# Altium schematic sheet AD Sensor Module - SC.SchDoc
size B
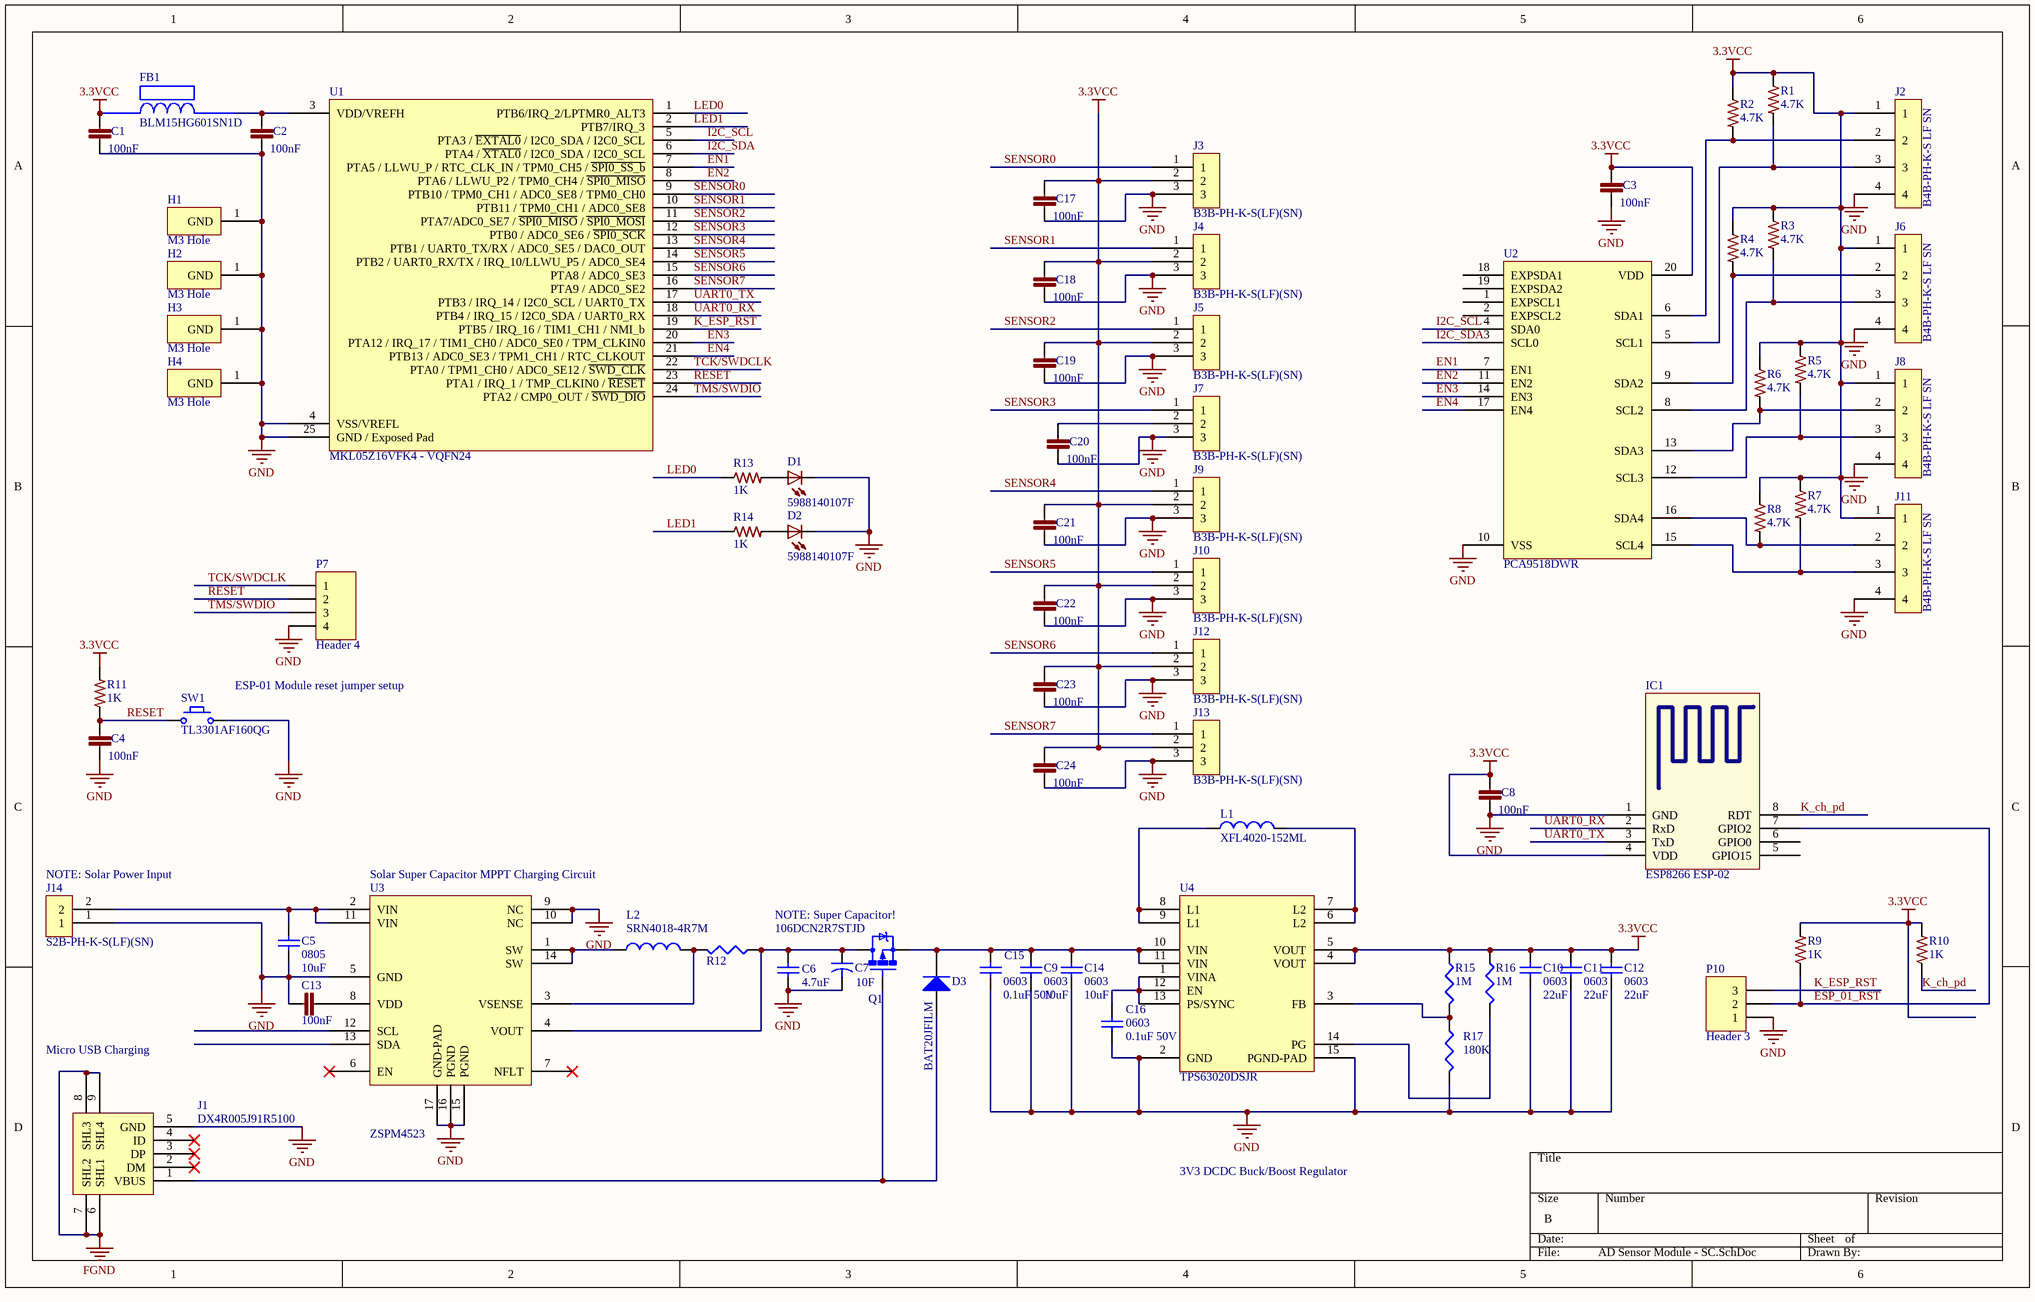
[diagram p0: AD Sensor Module - SC.SchDoc]

## Parts
C1  100nF  [C0402]
C2  100nF  [C0402]
C3  100nF  [C0402]
C4  100nF  [C0402]
C5  0805  value 10uF  [C0805]
C6  value 4.7uF  [C0805]  (hidden comment: CL21F475ZPFNNNE)
C7  106DCN2R7STJD  value 10F  [106DCN2R7STJD]
C8  100nF  [C0402]
C9  0603  value 10uF  [C0603]
C10  0603  value 22uF  [C0603]
C11  0603  value 22uF  [C0603]
C12  0603  value 22uF  [C0603]
C13  100nF  [C0402]
C14  0603  value 10uF  [C0603]
C15  0603  value 0.1uF 50V  [C0603]
C16  0603  value 0.1uF 50V  [C0603]
C17  100nF  [C0402]
C18  100nF  [C0402]
C19  100nF  [C0402]
C20  100nF  [C0402]
C21  100nF  [C0402]
C22  100nF  [C0402]
C23  100nF  [C0402]
C24  100nF  [C0402]
D1  5988140107F  [LED2012120]
D2  5988140107F  [LED2012120]
D3  BAT20JFILM  [BAT20JFILM - DIOM1712X11N]
FB1  BLM15HG601SN1D  [BLM18PG121SN1D]
H1  M3 Hole  [Hole-3mm]
H2  M3 Hole  [Hole-3mm]
H3  M3 Hole  [Hole-3mm]
H4  M3 Hole  [Hole-3mm]
IC1  ESP8266 ESP-02  [ESP8266 ESP-02]
J1  DX4R005J91R5100  [Micro USB Circular Holes Only]
J2  B4B-PH-K-S LF SN  [B4B-PH-K-S(LF)(SN)]
J3  B3B-PH-K-S(LF)(SN)  [B3B-PH-K-S(LF)(SN)]
J4  B3B-PH-K-S(LF)(SN)  [B3B-PH-K-S(LF)(SN)]
J5  B3B-PH-K-S(LF)(SN)  [B3B-PH-K-S(LF)(SN)]
J6  B4B-PH-K-S LF SN  [B4B-PH-K-S(LF)(SN)]
J7  B3B-PH-K-S(LF)(SN)  [B3B-PH-K-S(LF)(SN)]
J8  B4B-PH-K-S LF SN  [B4B-PH-K-S(LF)(SN)]
J9  B3B-PH-K-S(LF)(SN)  [B3B-PH-K-S(LF)(SN)]
J10  B3B-PH-K-S(LF)(SN)  [B3B-PH-K-S(LF)(SN)]
J11  B4B-PH-K-S LF SN  [B4B-PH-K-S(LF)(SN)]
J12  B3B-PH-K-S(LF)(SN)  [B3B-PH-K-S(LF)(SN)]
J13  B3B-PH-K-S(LF)(SN)  [B3B-PH-K-S(LF)(SN)]
J14  S2B-PH-K-S(LF)(SN)  [S2B-PH-K-S(LF)(SN)]
L1  XFL4020-152ML  [XFL4020-152ML - INDP4040X21N]
L2  SRN4018-4R7M  [SRN4018-4R7M - INDP4040X18N]
P7  Header 4  [HDR1X4]
P10  Header 3  [HDR1X3]
Q1  DMG2307L-7  [DMG2307L-7 - SOT92P240X102-3N]  (value not drawn)
R1  4.7K  [R0603]
R2  4.7K  [R0603]
R3  4.7K  [R0603]
R4  4.7K  [R0603]
R5  4.7K  [R0603]
R6  4.7K  [R0603]
R7  4.7K  [R0603]
R8  4.7K  [R0603]
R9  1K  [R0603]
R10  1K  [R0603]
R11  1K  [R0603]
R12  RU3216FR051CS  [R1206]  (value not drawn)
R13  1K  [R0603]
R14  1K  [R0603]
R15  value 1M  [R0603]  (hidden comment: RC1608F105CS)
R16  value 1M  [R0603]  (hidden comment: RC1608F105CS)
R17  value 180K  [R0603]  (hidden comment: RC1608F184CS)
SW1  TL3301AF160QG  [TL3301AF160QG]
U1  MKL05Z16VFK4 - VQFN24  [98ASA00474D]
U2  PCA9518DWR  [PCA9518DWR]
U3  ZSPM4523  [ZSPM4523 - QFN65P400X400X100_HS-17N]
U4  TPS63020DSJR  [TPS63020 - QFN50P400X300X100-22N]

## Nets
3.3VCC: C1.1 C3.1 C8.1 C10.2 C11.2 C12.2 C17.1 C18.1 C19.1 C21.1 C22.1 C23.1 C24.1 FB1.1 IC1.4(VDD) J2.1 J3.2 J4.2 J5.2 J6.1 J8.1 J9.2 J10.2 J11.1 J12.2 J13.2 R1.1 R2.1 R3.1 R4.1 R5.1 R6.1 R7.1 R8.1 R9.2 R10.2 R11.2 R15.1 R16.1 U2.20(VDD) U4.4(VOUT) U4.5(VOUT)
FGND: J1.6(SHL1) J1.7(SHL2) J1.8(SHL3) J1.9(SHL4)
GND: C1.2 C2.2 C3.2 C4.2 C5.1 C6.1 C7.2 C8.2 C9.1 C10.1 C11.1 C12.1 C13.2 C14.1 C15.1 C16.1 C17.2 C18.2 C19.2 C20.2 C21.2 C22.2 C23.2 C24.2 D1.C D2.C H1.1(GND) H2.1(GND) H3.1(GND) H4.1(GND) IC1.1(GND) J1.5(GND) J2.4 J3.3 J4.3 J5.3 J6.4 J7.3 J8.4 J9.3 J10.3 J11.4 J12.3 J13.3 J14.1 P7.4 P10.1 R17.2 SW1.2 U1.4(VSS/VREFL) U1.25(GND_/_Exposed_Pad) U2.10(VSS) U3.5(GND) U3.9(NC) U3.10(NC) U3.15(PGND) U3.16(PGND) U3.17(GND-PAD) U4.2(GND) U4.15(PGND-PAD)
EN1: U1.7(PTA5_/_LLWU_P_/_RTC_CLK_IN_/_TPM0_CH5_/_~{SPI0_SS_b}) U2.7(EN1)
EN2: U1.8(PTA6_/_LLWU_P2_/_TPM0_CH4_/_~{SPI0_MISO}) U2.11(EN2)
EN3: U1.20(PTA12_/_IRQ_17_/_TIM1_CH0_/_ADC0_SE0_/_TPM_CLKIN0) U2.14(EN3)
EN4: U1.21(PTB13_/_ADC0_SE3_/_TPM1_CH1_/_RTC_CLKOUT) U2.17(EN4)
ESP_01_RST: IC1.7(GPIO2) P10.2 R9.1
I2C_SCL: U1.5(PTA3_/_~{EXTAL0}_/_I2C0_SDA_/_I2C0_SCL) U2.4(SDA0)
I2C_SDA: U1.6(PTA4_/_~{XTAL0}_/_I2C0_SDA_/_I2C0_SCL) U2.3(SCL0)
K_ch_pd: IC1.8(RDT) R10.1
K_ESP_RST: P10.3 U1.19(PTB5_/_IRQ_16_/_TIM1_CH1_/_NMI_b)
LED0: R13.1 U1.1(PTB6/IRQ_2/LPTMR0_ALT3)
LED1: R14.1 U1.2(PTB7/IRQ_3)
RESET: C4.1 P7.2 R11.1 SW1.1 U1.23(PTA1_/_IRQ_1_/_TMP_CLKIN0_/_~{RESET})
SENSOR0: J3.1 U1.9(PTB10_/_TPM0_CH1_/_ADC0_SE8_/_TPM0_CH0)
SENSOR1: J4.1 U1.10(PTB11_/_TPM0_CH1_/_ADC0_SE8)
SENSOR2: J5.1 U1.11(PTA7/ADC0_SE7_/_~{SPI0_MISO}_/_~{SPI0_MOSI})
SENSOR3: J7.1 U1.12(PTB0_/_ADC0_SE6_/_~{SPI0_SCK})
SENSOR4: J9.1 U1.13(PTB1_/_UART0_TX/RX_/_ADC0_SE5_/_DAC0_OUT)
SENSOR5: J10.1 U1.14(PTB2_/_UART0_RX/TX_/_IRQ_10/LLWU_P5_/_ADC0_SE4)
SENSOR6: J12.1 U1.15(PTA8_/_ADC0_SE3)
SENSOR7: J13.1 U1.16(PTA9_/_ADC0_SE2)
TCK/SWDCLK: P7.1 U1.22(PTA0_/_TPM1_CH0_/_ADC0_SE12_/_~{SWD_CLK})
TMS/SWDIO: P7.3 U1.24(PTA2_/_CMP0_OUT_/_~{SWD_DIO})
UART0_RX: IC1.2(RxD) U1.18(PTB4_/_IRQ_15_/_I2C0_SDA_/_UART0_RX)
UART0_TX: IC1.3(TxD) U1.17(PTB3_/_IRQ_14_/_I2C0_SCL_/_UART0_TX)
NetC2_1: C2.1 FB1.2 U1.3(VDD/VREFH)
NetC5_2: C5.2 J14.2 U3.2(VIN) U3.11(VIN)
NetC6_2: C6.2 C7.1 Q1.3(D) R12.1 U3.4(VOUT)
NetC9_2: C9.2 C14.2 C15.2 D3.1(A) Q1.2(S) U4.10(VIN) U4.11(VIN)
NetC13_1: C13.1 U3.8(VDD)
NetC16_2: C16.2 U4.1(VINA) U4.12(EN) U4.13(PS/SYNC)
NetC20_1: C20.1 J7.2
NetD1_A: D1.A R13.2
NetD2_A: D2.A R14.2
NetD3_2: D3.2(K) J1.1(VBUS) Q1.1(G)
NetJ2_2: J2.2 R2.2 U2.6(SDA1)
NetJ2_3: J2.3 R1.2 U2.5(SCL1)
NetJ6_2: J6.2 R4.2 U2.9(SDA2)
NetJ6_3: J6.3 R3.2 U2.8(SCL2)
NetJ8_2: J8.2 R6.2 U2.13(SDA3)
NetJ8_3: J8.3 R5.2 U2.12(SCL3)
NetJ11_2: J11.2 R8.2 U2.16(SDA4)
NetJ11_3: J11.3 R7.2 U2.15(SCL4)
NetL1_1: L1.1 U4.8(L1) U4.9(L1)
NetL1_2: L1.2 U4.6(L2) U4.7(L2)
NetL2_1: L2.1 U3.1(SW) U3.14(SW)
NetL2_2: L2.2 R12.2 U3.3(VSENSE)
NetR15_2: R15.2 R17.1 U4.3(FB)
NetR16_2: R16.2 U4.14(PG)

Not connected (* = marked no-connect by the designer): IC1 5(GPIO15) 6(GPIO0); J1 2(DM)* 3(DP)* 4(ID)*; U2 1(EXPSCL1) 2(EXPSCL2) 18(EXPSDA1) 19(EXPSDA2); U3 6(EN)* 7(NFLT)* 12(SCL) 13(SDA)

## Notes on the sheet
- ESP-01 Module reset jumper setup
- (near J14) NOTE: Solar Power Input
- (near U3) Solar Super Capacitor MPPT Charging Circuit
- NOTE: Super Capacitor!
- Micro USB Charging
- 3V3 DCDC Buck/Boost Regulator

## Library data of the parts
C1-C4 C8 C13 C17-C24 = GRM155R71C104KA88D: CAP CER 0402 100nF 16V 10% X7R; LastRevisionNote: ImportComponents; Published: 23-Apr-2014; Publisher: UltiMachine; LastRevisionDate: 23-Apr-2014; ManufacturerPartNumber: GRM155R71C104KA88D; VALUE: 100nF
C5 = CL21A106KPCLQNC: CAP CER 10UF 10V X5R 0805; MFR: Samsung Electro-Mechanics America, Inc.; Pin Count #: 2; Tolerance: 10%; Type: Capacitor / Passive; Lead-Free ?: Yes; Designer: Adam Vadala-Roth; MFR #: CL21A106KPCLQNC; Status: Available; Mounting: SMT; Datasheet: https://media.digikey.com/pdf/Data%20Sheets/Samsung%20PDFs/CL21A106KPCLQNC_character.pdf; Height: 0.95mm; Cost: $0.03010; Voltage: 10V; Date Created: 25 Feb 2016; Last Modified: 25 Feb 2016; Valie: 10uF
C6 = CL21F475ZPFNNNE: CAP CER 4.7UF 10V Y5V 0805; MFR: Samsung Electro-Mechanics America, Inc.; Pin Count #: 2; Tolerance: 20%; Type: Capacitor/Passive; Lead-Free ?: Yes; Designer: Adam Vadala-Roth; MFR #: CL21F475ZPFNNNE; Status: Available; Mounting: SMT; Datasheet: http://www.samsungsem.com/kr/support/product-search/mlcc/__icsFiles/afieldfile/2015/08/14/S_CL21F475ZPFNNNE.pdf; Height: 1.35mm; Cost: 0.01505; Voltage: 10V; Date Created: 25 Feb 2016; Last Modified: 25 Feb 2016
C7 = 106DCN2R7STJD: CAP 10F -20%, +50% 2.7V T/H; MFR: Illinois Capacitor; Pin Count #: 2; Tolerance: 20%; Type: Super Capacitor; Lead-Free ?: Yes; Voltage: 2.7VDC; Designer: Adam Vadala-Roth; MFR #: 106DCN2R7STJD; Status: Available - Digikey; Mounting: Through hole; Datasheet: http://www.illinoiscapacitor.com/pdf/seriesDocuments/DCN%20series.pdf; Height: 27mm; Cost: $0.811; Date Created: 25 Feb 2016; Last Modified: 25 Feb 2016
C9 C14 = CL10A106KQ8NNNC: CAP CER 10UF 6.3V X5R 0603; MFR: Samsung Electro-Mechanics America, Inc.; Pin Count #: 2; Tolerance: 10%; Type: Capacitor / Passive; Lead-Free ?: Yes; Designer: Adam Vadala-Roth; MFR #: CL10A106KQ8NNNC; Status: Available; Mounting: SMT; Datasheet: http://www.samsungsem.com/kr/support/product-search/mlcc/__icsFiles/afieldfile/2015/08/14/S_CL10A106KQ8NNNC.pdf; Height: 0.9mm; Cost: $0.05145; Voltage: 6.3V; Date Created: 25 Feb 2016; Last Modified: 25 Feb 2016
C10-C12 = CL10A226KQ8NRNE: CAP CER 22UF 6.3V X5R 0603; MFR: Samsung Electro-Mechanics America, Inc.; Pin Count #: 2; Tolerance: 10%; Type: Capacitor / Passive; Lead-Free ?: Yes; Designer: Adam Vadala-Roth; MFR #: CL10A226KQ8NRNE; Status: Available; Mounting: SMT; Datasheet: https://media.digikey.com/pdf/Data%20Sheets/Samsung%20PDFs/CL10A226KQ8NRNE_Spec.pdf; Height: 0.9mm; Cost: $0.07416 @ 3000; Voltage: 6.3V; Date Created: 25 Feb 2016; Last Modified: 25 Feb 2016
C15 C16 = CL10B104KB8SFNC: CAP CER 0.1UF 50V 10% X7R 0603; MFR: Samsung; Voltage: 50VDC; Published: 10 - Dec - 2014; LatestRevisionDate: April 2015; Component Type: Chip Capacitor; MFR Part #: CL10B104KB8SFNC; Part Description: CAP CER 0.1UF 50V 10% X7R 0603; Mounting Type: SMT 0603; Datasheet: http://www.samsungsem.com/kr/front/downloadcms.do?path=/kr/support/product-search/mlcc/__icsFiles/afieldfile/2014/11/05&fileName=S_CL10B104KB8SFNC.pdf; Height: 0.9mm; Tolerance: 10%; Digikey #: 1276-1936-1-ND; PackageReference: 0603
D1 D2 = 5988140107F: LED 0805 Yellow; LastRevisionNote: ImportComponents; Published: 23-Apr-2014; Publisher: UltiMachine; LastRevisionDate: 23-Apr-2014; VALUE: 5988140107F
D3 = BAT20JFILM: DIODE SCHOTTKY 23V 1A SOD323; MFR: ST Microelectronics; Designer: Adam J Valala-Roth; Published: 25 Feb 2016; LatestRevisionDate: 25 Feb 2016; Mounting: SMT; Publisher: Altium Limited; Package: DO-214-AB/SMC; 2 C-Bend Leads; Body 7.9 x 5.9 mm, inc. leads (LxW); MFR#: BAT20JFILM; Digikey #: 497-3381-1-ND; Height: *; Cost: $0.44
H1-H4 = Hole: 3mm Hole
J1 = Micro USB: Micro USB Jack B
J2 J6 J8 J11 = B4B-PH-K-S LF SN: CONN HEADER PH TOP 4POS 2MM; MFR: JST; Pin Count #: 2; Lead-Free ?: Yes; Designer: Adam Vadala-Roth; MFR #: B4B-PH-K-S(LF)(SN); Status: Available; Mounting: Throughhole; Datasheet: http://www.jst-mfg.com/product/pdf/eng/ePH.pdf; Height: *; Tolerance: *; Cost: $0.24; Type: Connector 2mm Pitch Shrouded Pin; Voltage: *; Date Created: 26 Feb 2016; Last Modified: 26 Feb 2016
J3-J5 J7 J9 J10 J12 J13 = B3B-PH-K-S(LF)(SN): CONN HEADER PH TOP 3POS 2MM; MFR: JST; Pin Count #: 2; Lead-Free ?: Yes; Designer: Adam Vadala-Roth; MFR #: B3B-PH-K-S(LF)(SN); Status: Available; Mounting: Throughhole; Datasheet: http://www.jst-mfg.com/product/pdf/eng/ePH.pdf; Height: *; Tolerance: *; Cost: $0.19; Type: Connector 2mm Pitch Shrouded Pin; Voltage: *; Date Created: 26 Feb 2016; Last Modified: 26 Feb 2016
J14 = S2B-PH-K-S(LF)(SN): CONN HEADER PH SIDE 2POS 2MM; MFR: JST; Pin Count #: 2; Lead-Free ?: Yes; Designer: Adam Vadala-Roth; MFR #: S2B-PH-K-S(LF)(SN); Status: Available; Mounting: Throughhole; Datasheet: http://www.jst-mfg.com/product/pdf/eng/ePH.pdf; Height: *; Tolerance: *; Cost: $0.17; Type: Connector 2mm Pitch Shrouded Pin; Voltage: *; Date Created: 26 Feb 2016; Last Modified: 26 Feb 2016
L1 = XFL4020-152ML: MFR #: Coilcraft; Pin Count #: 2; Type: Wire Wound Inductor; Lead-Free ?: Yes; Designer: Adam Vadala-Roth; MFR: Coilcraft; Status: Available; Mounting: SMT; Datasheet: http://www.coilcraft.com/pdfs/xfl4020.pdf; Height: 2.10mm; Tolerance: *; Cost: $0.45 @5000; Voltage: *; Date Created: 25 Feb 2016; Last Modified: 25 Feb 2016
L2 = SRN4018-4R7M: FIXED IND 4.7UH 1.9A 84 MOHM SMD; MFR: Bourns; Pin Count #: 2; Tolerance: +/-20%; Type: Inductor/Passive; Lead-Free ?: Yes; Designer: Adam Vadala-Roth; MFR #: SRN4018-4R7M; Status: Available; Mounting: SMT; Datasheet: http://www.bourns.com/docs/Product-Datasheets/SRN4018.pdf; Height: 1.8mm; Cost: $0.13300; Voltage: *; Date Created: 25 Feb 2016; Last Modified: 25 Feb 2016
P7 = Header 4: Header, 4-Pin; LatestRevisionDate: 17-Jul-2002; LatestRevisionNote: Re-released for DXP Platform.; Publisher: Altium Limited
P10 = Header 3: Header, 3-Pin; LatestRevisionDate: 17-Jul-2002; LatestRevisionNote: Re-released for DXP Platform.; Publisher: Altium Limited
Q1 = DMG2307L-7: MOSFET P-CH 30V 2.5A SOT-23; MFR: Diodes Incorporated; Published: 25 Feb 2016; LatestRevisionDate: 25 Feb 2016; LatestRevisionNote: IPC-7351 Footprint Added.; PackageReference: SOT23 SMT package; Publisher: Adam Vadala-Roth; PackageDescription: SOT23; MFR#: DMG2307L-7
R1-R8 = ERJ3EKF4701V: RES 0603 4.7K 100mW 1%; LastRevisionNote: ImportComponents; Published: 23-Apr-2014; Publisher: UltiMachine; LastRevisionDate: 23-Apr-2014; ManufacturerPartNumber: ERJ3EKF4701V; VALUE: 4.7K
R9-R11 R13 R14 = ERJ-3EKF1001V: RES 0603 1K 100mW 1%; LastRevisionNote: ImportComponents; Published: 23-Apr-2014; Publisher: UltiMachine; LastRevisionDate: 23-Apr-2014; ManufacturerPartNumber: ERJ-3EKF1001V; VALUE: 1K
R12 = RU3216FR051CS: RES SMD 0.051 OHM 1% 1/2W 1206 Current Sense Resistor*; MFR: Samsung Electro-Mechanics America, Inc.; Pin Count #: 2; Lead-Free ?: Yes; Designer: Adam Vadala-Roth; MFR #: RU3216FR051CS; Status: Available; Mounting: SMT; Datasheet: https://media.digikey.com/pdf/Data%20Sheets/Samsung%20PDFs/RU_Series_ds.pdf; Height: 0.7mm; Tolerance: 1%; Cost: 0.03300; Type: Resistor / Passive; Voltage: *; Date Created: 25 Feb 2016; Last Modified: 25 Feb 2016
R15 R16 = RC1608F105CS: RES SMD 1M OHM 1% 1/10W 0603; MFR: Samsung Electro-Mechanics America, Inc.; Pin Count #: 2; Lead-Free ?: Yes; Designer: Adam Vadala-Roth; MFR #: RC1608F105CS; Status: Availble; Mounting: SMT; Datasheet: https://media.digikey.com/pdf/Data%20Sheets/Samsung%20PDFs/RC_Series_ds.pdf; Height: 0.55mm; Tolerance: 1%; Cost: $0.00167; Type: Resistor Passive; Voltage: *; Date Created: 25 Feb 2016; Last Modified: 25 Feb 2016
R17 = RC1608F184CS: RES SMD 180K OHM 1% 1/10W 060; MFR: Samsung Electro-Mechanics America, Inc.; Pin Count #: 2; Lead-Free ?: Yes; Designer: Adam Vadala-Roth; MFR #: RC1608F184CS; Status: Availble; Mounting: SMT; Datasheet: https://media.digikey.com/pdf/Data%20Sheets/Samsung%20PDFs/RC_Series_ds.pdf; Height: 0.55mm; Tolerance: 1%; Cost: $0.00167; Type: Resistor Passive; Voltage: *; Date Created: 25 Feb 2016; Last Modified: 25 Feb 2016
U1 = MKL05Z16VFK4 - 24 Pin VQFN: ARM Cortex M0+
U2 = PCA9518DWR: IC EXPANDABLE 5CH I2C HUB 20SOIC; MFR: Ti; MFR#: PCA9518DWR; Type: I2C Hub 20 Pin SOIC; Date Added: April 2015; Digikey#: 296-22766-1-ND
U3 = ZSPM4523: ZSPM4523 Charge Controller; MFR: ZMDI; Designer: Adam J Vadala-Roth; MFR #: ZSPM4523; Pins: 16; Type: IC; Date Created: 24-Feb-2016; Mounting: SMT; Package: QFN; Price: *
U4 = TPS63020: IC REG BUCK BST ADJ 3.5A 14VSON; MFR: Texas Instruments; Designer: Adam J Vadala-Roth; Descrition: IC REG BUCK BST ADJ 3.5A 14VSON; Date Created: 24 Feb 2016; MFR#: TPS63020DSJR; Price: $1.46 @ 3000; Mounting: SMT; Digikey #: 296-36491-2-ND; Height: *; Type: IC
SW1 = TL3301AF160QG: MFR: *; MFR#: TL3301AF160QG; Type: SMD Momentary Tactile Switch; Height: *